# Altium schematic sheet KEY_Pad.SchDoc
size A4
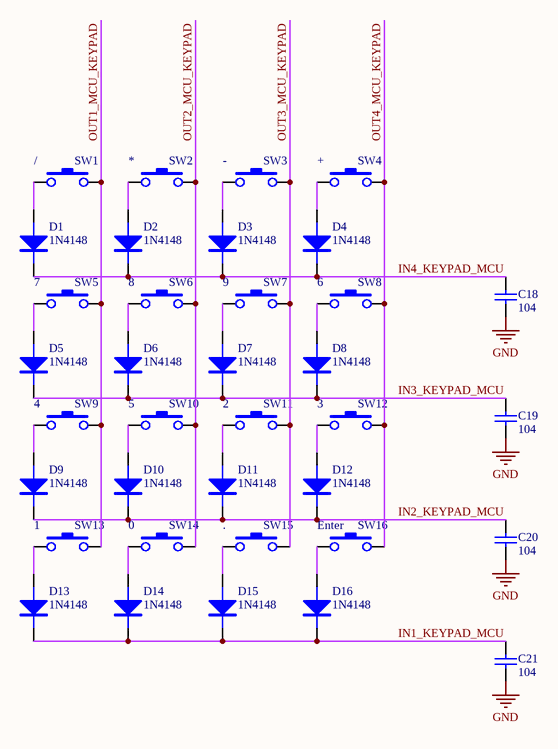
[diagram p0: KEY_Pad.SchDoc]

## Parts
C18  104  [Cap-0603]
C19  104  [Cap-0603]
C20  104  [Cap-0603]
C21  104  [Cap-0603]
D1  1N4148  [SOD-523]
D2  1N4148  [SOD-523]
D3  1N4148  [SOD-523]
D4  1N4148  [SOD-523]
D5  1N4148  [SOD-523]
D6  1N4148  [SOD-523]
D7  1N4148  [SOD-523]
D8  1N4148  [SOD-523]
D9  1N4148  [SOD-523]
D10  1N4148  [SOD-523]
D11  1N4148  [SOD-523]
D12  1N4148  [SOD-523]
D13  1N4148  [SOD-523]
D14  1N4148  [SOD-523]
D15  1N4148  [SOD-523]
D16  1N4148  [SOD-523]
SW1  /  [MX_SW-4]
SW2  *  [MX_SW-4]
SW3  -  [MX_SW-4]
SW4  +  [MX_SW-4]
SW5  7  [MX_SW-4]
SW6  8  [MX_SW-4]
SW7  9  [MX_SW-4]
SW8  6  [MX_SW-4]
SW9  4  [MX_SW-4]
SW10  5  [MX_SW-4]
SW11  2  [MX_SW-4]
SW12  3  [MX_SW-4]
SW13  1  [MX_SW-4]
SW14  0  [MX_SW-4]
SW15  .  [MX_SW-4]
SW16  Enter  [MX_SW-4]

## Nets
GND: C18.2 C19.2 C20.1 C21.1
IN1_KEYPAD_MCU: C21.2 D13.K D14.K D15.K D16.K
IN2_KEYPAD_MCU: C20.2 D9.K D10.K D11.K D12.K
IN3_KEYPAD_MCU: C19.1 D5.K D6.K D7.K D8.K
IN4_KEYPAD_MCU: C18.1 D1.K D2.K D3.K D4.K
OUT1_MCU_KEYPAD: SW1.2 SW5.2 SW9.2 SW13.2
OUT2_MCU_KEYPAD: SW2.2 SW6.2 SW10.2 SW14.2
OUT3_MCU_KEYPAD: SW3.2 SW7.2 SW11.2 SW15.2
OUT4_MCU_KEYPAD: SW4.2 SW8.2 SW12.2 SW16.2
NetD1_A: D1.A SW1.1
NetD2_A: D2.A SW2.1
NetD3_A: D3.A SW3.1
NetD4_A: D4.A SW4.1
NetD5_A: D5.A SW5.1
NetD6_A: D6.A SW6.1
NetD7_A: D7.A SW7.1
NetD8_A: D8.A SW8.1
NetD9_A: D9.A SW9.1
NetD10_A: D10.A SW10.1
NetD11_A: D11.A SW11.1
NetD12_A: D12.A SW12.1
NetD13_A: D13.A SW13.1
NetD14_A: D14.A SW14.1
NetD15_A: D15.A SW15.1
NetD16_A: D16.A SW16.1

## Library data of the parts
C18-C21 = CAP: 贴片陶瓷电容
D1-D16 = DIODE: 普通二极管
SW1-SW16 = MX_SW-4: with Fixation pins  1-Pole